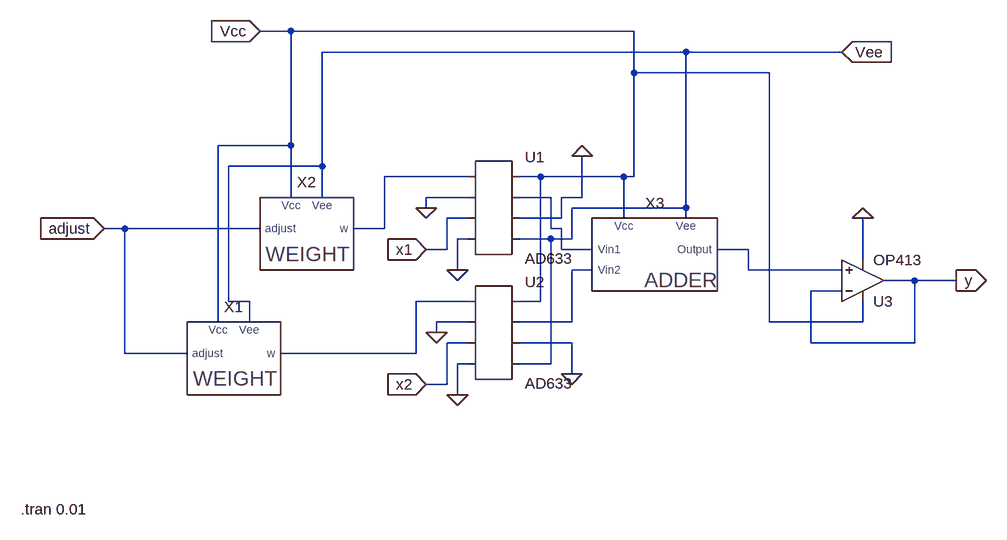
[diagram p0: schematic neuron_unit.asc]
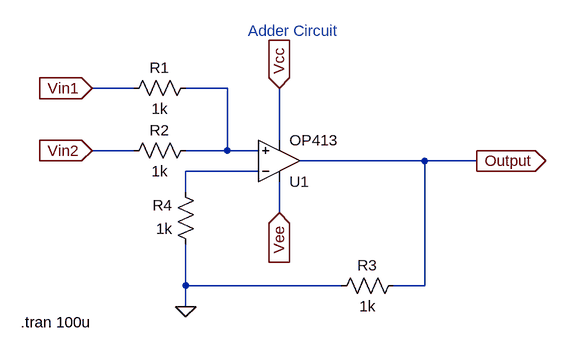
[diagram p1: sub-circuit adder.asc]
neuron_unit.asc, the LTspice schematic file:
Version 4
SHEET 1 1096 680
WIRE 0 -208 -48 -208
WIRE 528 -208 0 -208
WIRE 608 -176 48 -176
WIRE 848 -176 608 -176
WIRE 528 -144 528 -208
WIRE 736 -144 528 -144
WIRE 0 -32 0 -208
WIRE 0 -32 -112 -32
WIRE 48 0 48 -176
WIRE 48 0 -96 0
WIRE 272 16 144 16
WIRE 384 16 352 16
WIRE 512 16 384 16
WIRE 528 16 528 -144
WIRE 528 16 512 16
WIRE 0 48 0 -32
WIRE 48 48 48 0
WIRE 272 48 208 48
WIRE 400 48 352 48
WIRE 448 48 448 -16
WIRE 448 48 416 48
WIRE 208 64 208 48
WIRE 608 64 608 -176
WIRE 608 64 432 64
WIRE 272 80 240 80
WIRE 416 80 416 48
WIRE 416 80 352 80
WIRE 512 80 512 16
WIRE 608 80 608 64
WIRE -256 96 -288 96
WIRE -48 96 -256 96
WIRE 144 96 144 16
WIRE 144 96 96 96
WIRE 400 96 400 48
WIRE 416 96 400 96
WIRE 272 112 256 112
WIRE 400 112 352 112
WIRE 432 112 432 64
WIRE 432 112 400 112
WIRE 240 128 240 80
WIRE 240 128 208 128
WIRE 416 128 416 96
WIRE 464 128 416 128
WIRE 704 128 656 128
WIRE 880 144 880 80
WIRE 256 160 256 112
WIRE 464 160 432 160
WIRE 704 160 704 128
WIRE 848 160 704 160
WIRE 960 176 912 176
WIRE 1024 176 960 176
WIRE 848 192 800 192
WIRE -96 208 -96 0
WIRE -64 208 -96 208
WIRE 272 208 192 208
WIRE 384 208 384 16
WIRE 384 208 352 208
WIRE -112 240 -112 -32
WIRE -64 240 -64 208
WIRE 272 240 224 240
WIRE 432 240 432 160
WIRE 432 240 352 240
WIRE 736 240 736 -144
WIRE 880 240 880 208
WIRE 880 240 736 240
WIRE 224 256 224 240
WIRE 272 272 240 272
WIRE 432 272 352 272
WIRE 800 272 800 192
WIRE 960 272 960 176
WIRE 960 272 800 272
WIRE -256 288 -256 96
WIRE -160 288 -256 288
WIRE 192 288 192 208
WIRE 192 288 -16 288
WIRE 272 304 256 304
WIRE 400 304 400 112
WIRE 400 304 352 304
WIRE 432 320 432 272
WIRE 240 336 240 272
WIRE 240 336 208 336
WIRE 256 352 256 304
FLAG -48 -208 Vcc
IOPIN -48 -208 In
FLAG 848 -176 Vee
IOPIN 848 -176 In
FLAG 208 64 0
FLAG 224 256 0
FLAG 256 352 0
FLAG 256 160 0
FLAG 208 128 x1
IOPIN 208 128 In
FLAG 208 336 x2
IOPIN 208 336 In
FLAG -288 96 adjust
IOPIN -288 96 In
FLAG 448 -16 0
FLAG 432 320 0
FLAG 880 80 0
FLAG 1024 176 y
IOPIN 1024 176 Out
SYMBOL Weight -96 288 R0
SYMATTR InstName X1
SYMBOL Weight 16 96 R0
SYMATTR InstName X2
SYMBOL Adder 560 144 R0
SYMATTR InstName X3
SYMBOL OpAmps\\OP413 880 240 M180
SYMATTR InstName U3
SYMBOL AutoGenerated\\AD633 304 64 R0
SYMATTR InstName U1
SYMBOL AutoGenerated\\AD633 304 256 R0
SYMATTR InstName U2
TEXT -416 528 Left 2 !.tran 0.01

adder.asc, the sub-circuit schematic file:
Version 4
SHEET 1 880 680
WIRE -176 -48 -240 -48
WIRE -32 -48 -96 -48
WIRE 48 32 48 -48
WIRE -176 48 -240 48
WIRE -32 48 -32 -48
WIRE -32 48 -96 48
WIRE 16 48 -32 48
WIRE 272 64 80 64
WIRE 352 64 272 64
WIRE 16 80 -96 80
WIRE -96 112 -96 80
WIRE 48 144 48 96
WIRE -96 256 -96 192
WIRE 144 256 -96 256
WIRE 272 256 272 64
WIRE 272 256 224 256
WIRE -96 288 -96 256
FLAG -96 288 0
FLAG 352 64 Output
IOPIN 352 64 Out
FLAG -240 -48 Vin1
IOPIN -240 -48 In
FLAG -240 48 Vin2
IOPIN -240 48 In
FLAG 48 -48 Vcc
IOPIN 48 -48 In
FLAG 48 144 Vee
IOPIN 48 144 In
SYMBOL res -80 -64 R90
WINDOW 0 0 56 VBottom 2
WINDOW 3 32 56 VTop 2
SYMATTR InstName R1
SYMATTR Value 1k
SYMBOL res -80 32 R90
WINDOW 0 0 56 VBottom 2
WINDOW 3 32 56 VTop 2
SYMATTR InstName R2
SYMATTR Value 1k
SYMBOL res 240 240 R90
WINDOW 0 0 56 VBottom 2
WINDOW 3 32 56 VTop 2
SYMATTR InstName R3
SYMATTR Value 1k
SYMBOL res -80 208 R180
WINDOW 0 36 76 Left 2
WINDOW 3 36 40 Left 2
SYMATTR InstName R4
SYMATTR Value 1k
SYMBOL OpAmps\\OP413 48 128 M180
SYMATTR InstName U1
TEXT 0 -136 Left 2 ;Adder Circuit
TEXT -350 312 Left 2 !.tran 100u

The netlist it stands for:
* neuron_unit.asc
XX1 adjust Vcc Vee N005 Weight  ; pins adjust Vcc Vee w
XX2 adjust Vcc Vee N001 Weight  ; pins adjust Vcc Vee w
XX3 Vcc Vee N002 N004 N003 adder
XU3 N003 y Vcc 0 y OP413  ; pins In+ In- V+ V- OUT
* U1: AD633 (symbol AutoGenerated\AD633 not available, pins judged from their places): pin1=N001 pin2=0 pin3=x1 pin4=0 pin5=Vcc pin6=N002 pin7=0 pin8=Vee
* U2: AD633 (symbol AutoGenerated\AD633 not available, pins judged from their places): pin1=N005 pin2=0 pin3=x2 pin4=0 pin5=Vcc pin6=N004 pin7=0 pin8=Vee

* block symbol definitions
.subckt adder Vcc Vee Vin1 Vin2 Output
R1 N001 Vin1 1k
R2 N001 Vin2 1k
R3 Output 0 1k
R4 0 N002 1k
XU1 N001 N002 Vee Vcc Output OP413  ; pins In+ In- V+ V- OUT
* Adder Circuit
.tran 100u
.ends adder

.tran 0.01
.backanno
.end